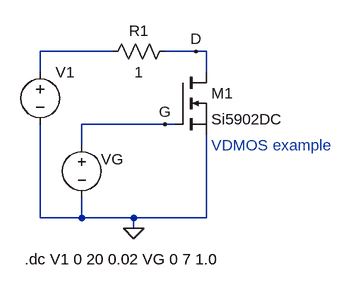
[diagram p0: schematic Fig_6-19_Si5902DC_FET_V-I.asc]
Fig_6-19_Si5902DC_FET_V-I.asc, the LTspice schematic file:
Version 4
SHEET 1 880 680
WIRE 96 96 -16 96
WIRE 224 96 176 96
WIRE 240 96 224 96
WIRE -16 128 -16 96
WIRE 240 128 240 96
WIRE 176 208 48 208
WIRE 192 208 176 208
WIRE 48 240 48 208
WIRE -16 352 -16 208
WIRE 48 352 48 320
WIRE 48 352 -16 352
WIRE 128 352 48 352
WIRE 240 352 240 224
WIRE 240 352 128 352
WIRE 128 368 128 352
FLAG 128 368 0
FLAG 224 96 D
FLAG 176 208 G
SYMBOL voltage -16 112 R0
WINDOW 123 0 0 Left 2
WINDOW 39 0 0 Left 2
SYMATTR InstName V1
SYMATTR Value ""
SYMBOL nmos 192 128 R0
SYMATTR InstName M1
SYMATTR Value Si5902DC
SYMBOL voltage 48 224 R0
WINDOW 123 0 0 Left 2
WINDOW 39 0 0 Left 2
WINDOW 0 30 38 Left 2
SYMATTR InstName VG
SYMATTR Value ""
SYMBOL res 80 112 R270
WINDOW 0 32 56 VTop 2
WINDOW 3 0 56 VBottom 2
SYMATTR InstName R1
SYMATTR Value 1
TEXT -40 416 Left 2 !.dc V1 0 20 0.02 VG 0 7 1.0
TEXT 248 240 Left 2 ;VDMOS example

The netlist it stands for:
* Fig_6-19_Si5902DC_FET_V-I.asc
V1 N001 0
M1 D G 0 0 Si5902DC
VG G 0
R1 N001 D 1
.model NMOS NMOS
.model PMOS PMOS
.lib standard.mos
.dc V1 0 20 0.02 VG 0 7 1.0
* VDMOS example
.backanno
.end